# Altium schematic sheet top.SchDoc
size A
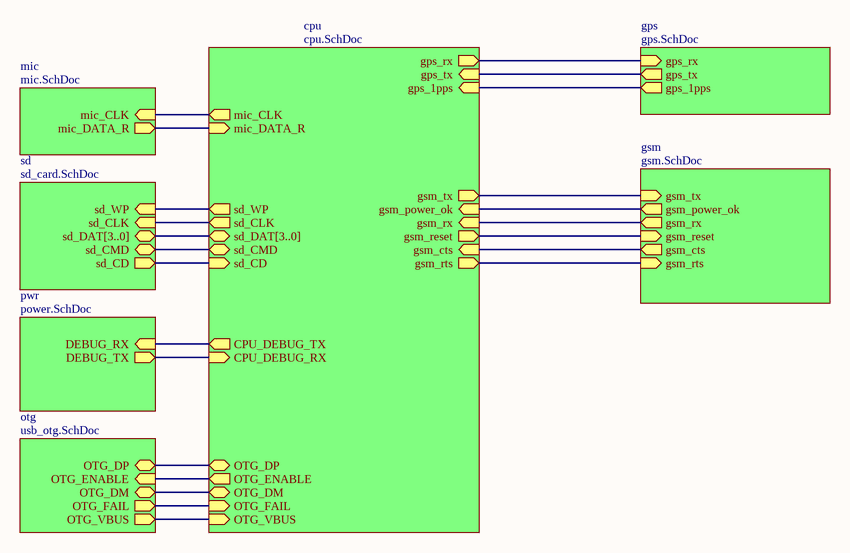
[diagram p0: top.SchDoc]

## Sub-sheets
cpu = cpu.SchDoc: gps_rx (out), gps_tx (in), gps_1pps (in), gsm_cts (in), gsm_reset (out), gsm_rx (in), gsm_rts (out), gsm_tx (out), gsm_power_ok (in), mic_CLK (out), mic_DATA_R (in), sd_WP (out), sd_CLK (out), sd_DAT[3..0] (bidir), sd_CMD (bidir), sd_CD (in), CPU_DEBUG_RX (in), CPU_DEBUG_TX (out), OTG_ENABLE (out), OTG_DP (bidir), OTG_VBUS (in), OTG_FAIL (in), OTG_DM (bidir)
gps = gps.SchDoc: gps_rx (in), gps_tx (out), gps_1pps (out)
gsm = gsm.SchDoc: gsm_tx (in), gsm_power_ok (out), gsm_rx (out), gsm_reset (in), gsm_cts (out), gsm_rts (in)
mic = mic.SchDoc: mic_CLK (in), mic_DATA_R (out)
otg = usb_otg.SchDoc: OTG_DP (bidir), OTG_ENABLE (in), OTG_DM (bidir), OTG_FAIL (out), OTG_VBUS (out)
pwr = power.SchDoc: DEBUG_RX (in), DEBUG_TX (out)
sd = sd_card.SchDoc: sd_WP (in), sd_CD (out), sd_CMD (bidir), sd_CLK (in), sd_DAT[3..0] (bidir)

## Nets
(unnamed): sheet cpu/gps_rx, sheet gps/gps_rx
(unnamed): sheet cpu/gps_tx, sheet gps/gps_tx
(unnamed): sheet cpu/gps_1pps, sheet gps/gps_1pps
(unnamed): sheet cpu/gsm_cts, sheet gsm/gsm_cts
(unnamed): sheet cpu/gsm_reset, sheet gsm/gsm_reset
(unnamed): sheet cpu/gsm_rx, sheet gsm/gsm_rx
(unnamed): sheet cpu/gsm_rts, sheet gsm/gsm_rts
(unnamed): sheet cpu/gsm_tx, sheet gsm/gsm_tx
(unnamed): sheet cpu/gsm_power_ok, sheet gsm/gsm_power_ok
(unnamed): sheet cpu/mic_CLK, sheet mic/mic_CLK
(unnamed): sheet cpu/mic_DATA_R, sheet mic/mic_DATA_R
(unnamed): sheet cpu/sd_WP, sheet sd/sd_WP
(unnamed): sheet cpu/sd_CLK, sheet sd/sd_CLK
(unnamed): sheet cpu/sd_CMD, sheet sd/sd_CMD
(unnamed): sheet cpu/sd_CD, sheet sd/sd_CD
(unnamed): sheet cpu/CPU_DEBUG_RX, sheet pwr/DEBUG_TX
(unnamed): sheet cpu/CPU_DEBUG_TX, sheet pwr/DEBUG_RX
(unnamed): sheet cpu/OTG_ENABLE, sheet otg/OTG_ENABLE
(unnamed): sheet cpu/OTG_DP, sheet otg/OTG_DP
(unnamed): sheet cpu/OTG_VBUS, sheet otg/OTG_VBUS
(unnamed): sheet cpu/OTG_FAIL, sheet otg/OTG_FAIL
(unnamed): sheet cpu/OTG_DM, sheet otg/OTG_DM

## Buses and harness runs
bus sheet cpu/sd_DAT[3..0] = sheet sd/sd_DAT[3..0]